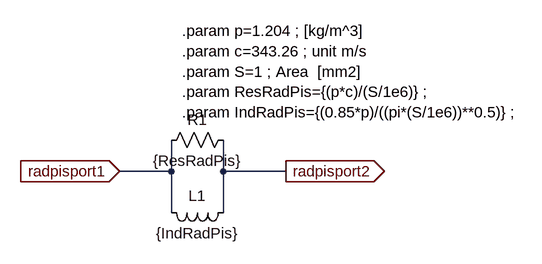
[diagram p0: schematic RadPisModel.asc]
RadPisModel.asc, the LTspice schematic file:
Version 4
SHEET 1 1216 680
WIRE 192 480 192 432
WIRE 192 480 112 480
WIRE 272 480 272 432
WIRE 368 480 272 480
WIRE 192 544 192 480
WIRE 272 544 272 480
FLAG 112 480 radpisport1
IOPIN 112 480 In
FLAG 368 480 radpisport2
IOPIN 368 480 Out
SYMBOL res 288 416 R90
WINDOW 0 0 56 VBottom 2
WINDOW 3 32 56 VTop 2
SYMATTR InstName R1
SYMATTR Value {ResRadPis}
SYMBOL ind 288 528 R90
WINDOW 0 5 56 VBottom 2
WINDOW 3 32 56 VTop 2
SYMATTR InstName L1
SYMATTR Value {IndRadPis}
TEXT 208 264 Left 2 !.param p=1.204 ; [kg/m^3]\n.param c=343.26 ; unit m/s\n.param S=1 ; Area  [mm2]\n.param ResRadPis={(p*c)/(S/1e6)} ;\n.param IndRadPis={(0.85*p)/((pi*(S/1e6))**0.5)} ;

The netlist it stands for:
* RadPisModel.asc
R1 radpisport2 radpisport1 {ResRadPis}
L1 radpisport2 radpisport1 {IndRadPis}
.param p=1.204 ; [kg/m^3]
.param c=343.26 ; unit m/s
.param S=1 ; Area  [mm2]
.param ResRadPis={(p*c)/(S/1e6)} ;
.param IndRadPis={(0.85*p)/((pi*(S/1e6))**0.5)} ;
.backanno
.end